# EAGLE schematic light2pwm (EAGLE 7.1.0)
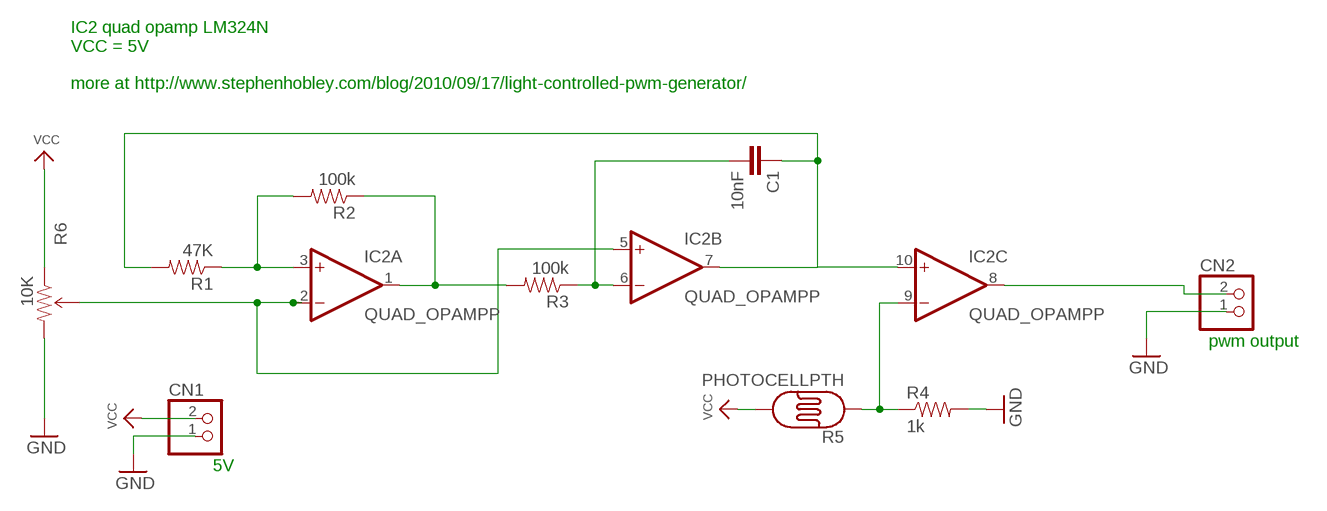
[diagram p0: schematic, sheet 1]

## Parts
C1  10nF  10NF-CER  [0402-CAP]
CN1  JST_2PIN-THM  [JST-PH-2-THM]
CN2  JST_2PIN-THM  [JST-PH-2-THM]
IC2  QUAD_OPAMPP  [DIL14]
R1  47K  RESISTOREZ  [AXIAL-0.3EZ]
R2  100k  RESISTOREZ  [AXIAL-0.3EZ]
R3  100k  RESISTOREZ  [AXIAL-0.3EZ]
R4  1k  RESISTOREZ  [AXIAL-0.3EZ]
R5  PHOTOCELLPTH  [PHOTOCELL]
R6  10K  TRIMPOT-PTH-KNOB  [3386U]

## Nets
GND: CN1.1 CN2.1 R4.P$2 R6.3(CW)
N$1: IC2.3(A:+IN) R1.P$1 R2.P$2
N$2: C1.1 IC2.7(B:OUT) IC2.10(C:+IN) R1.P$2
N$3: IC2.1(A:OUT) R2.P$1 R3.P$2
N$4: IC2.2(A:-IN) IC2.5(B:+IN) R6.2(WIPER)
N$5: C1.2 IC2.6(B:-IN) R3.P$1
N$7: CN2.2 IC2.8(C:OUT)
N$8: IC2.9(C:-IN) R4.P$1 R5.1
VCC: CN1.2 R5.2 R6.1(CCW)
Unconnected: IC2.12(D:+IN) IC2.13(D:-IN) IC2.14(D:OUT)

## Notes on the sheet
- IC2 quad opamp LM324N
  VCC = 5V
  
  more at http://www.stephenhobley.com/blog/2010/09/17/light-controlled-pwm-generator/
- pwm output
- 5V

## Power pins joined to a net without a drawn wire
V+: IC2.4(P:V+)
V-: IC2.11(P:V-)

## Library data of the parts
C1 = SparkFun-Retired:10NF-CER: 10nF/.01uF/10000pF ceramic SMT CAP-00867- 50V 10% (0603); PROD_ID: CAP-00867
CN1 CN2 = adafruit:JST_2PIN: JST 2-Pin Connectors of various flavors SMT-RA (S2B-PH-SM4) 4UConnector #17311 SMT (B2B-PH-SM4) THM-RA (S2B-PH) THM (B2B-PH)
IC2 = adafruit:QUAD_OPAMP: OP AMP Standard quad package
R1-R4 = SparkFun-Resistors:RESISTOR: Resistor Basic schematic elements and footprints for 0603, 1206, and PTH resistors.
R5 = SparkFun-Sensors:PHOTOCELL: CdS photoresistor. This is a low cost way to detect light levels. Resistance decreases with more incoming light. SparkFun SKU: SEN-09088
R6 = SparkFun-Electromechanical:TRIMPOT: Various small potentiometers for "set-and-forget" applications